# Altium schematic sheet Sheet1.SchDoc
size A2; SheetNumber: 1; SheetTotal: 1
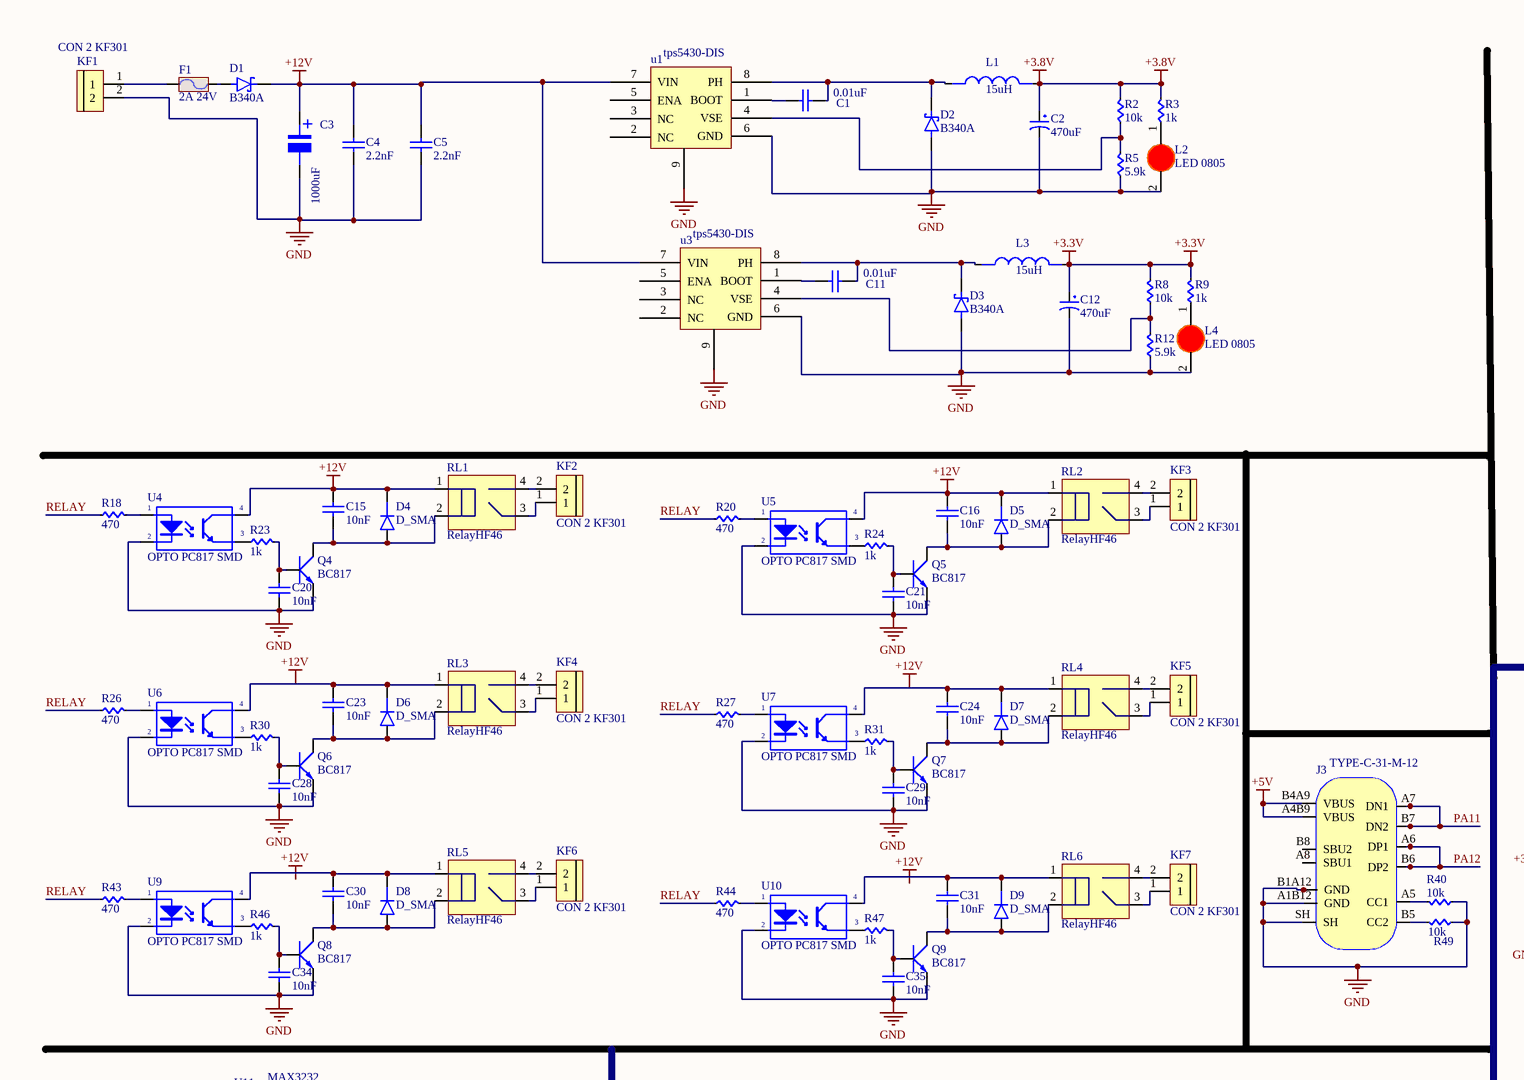
[diagram p0: Sheet1.SchDoc, top left]
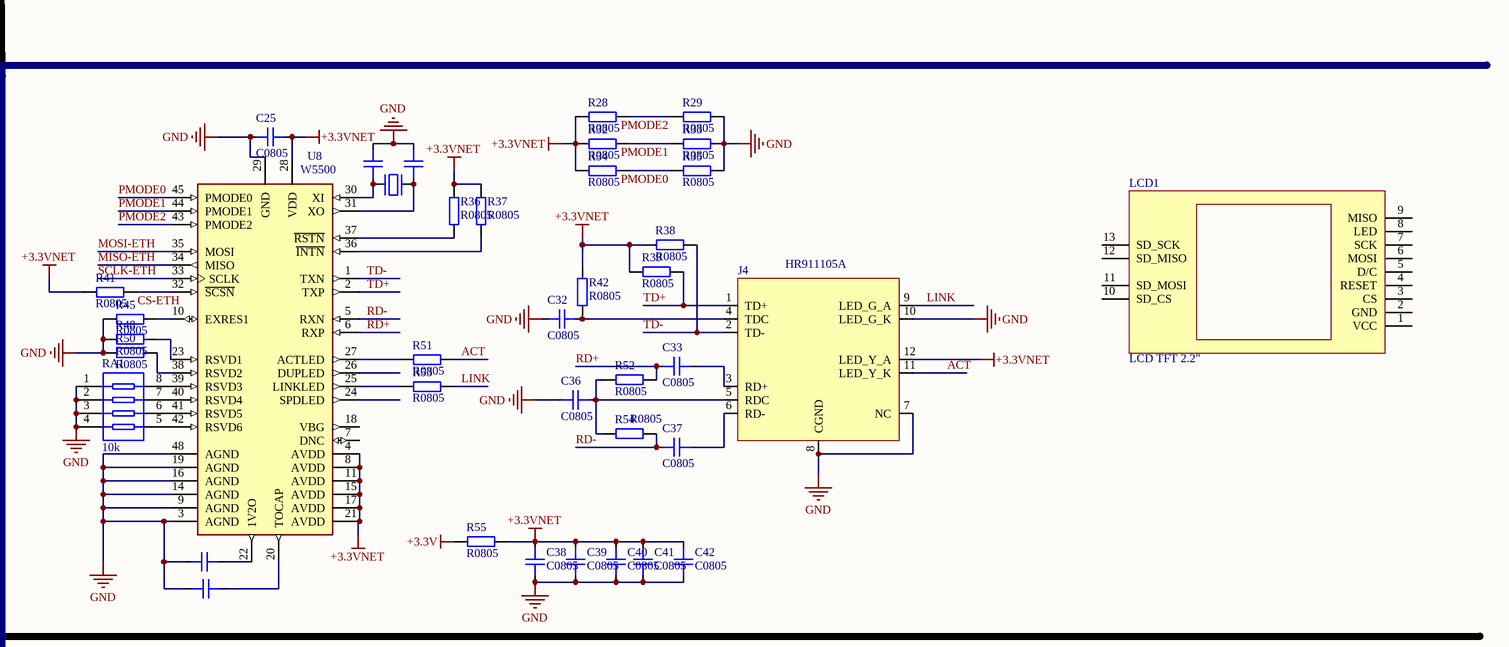
[diagram p1: Sheet1.SchDoc, top right]
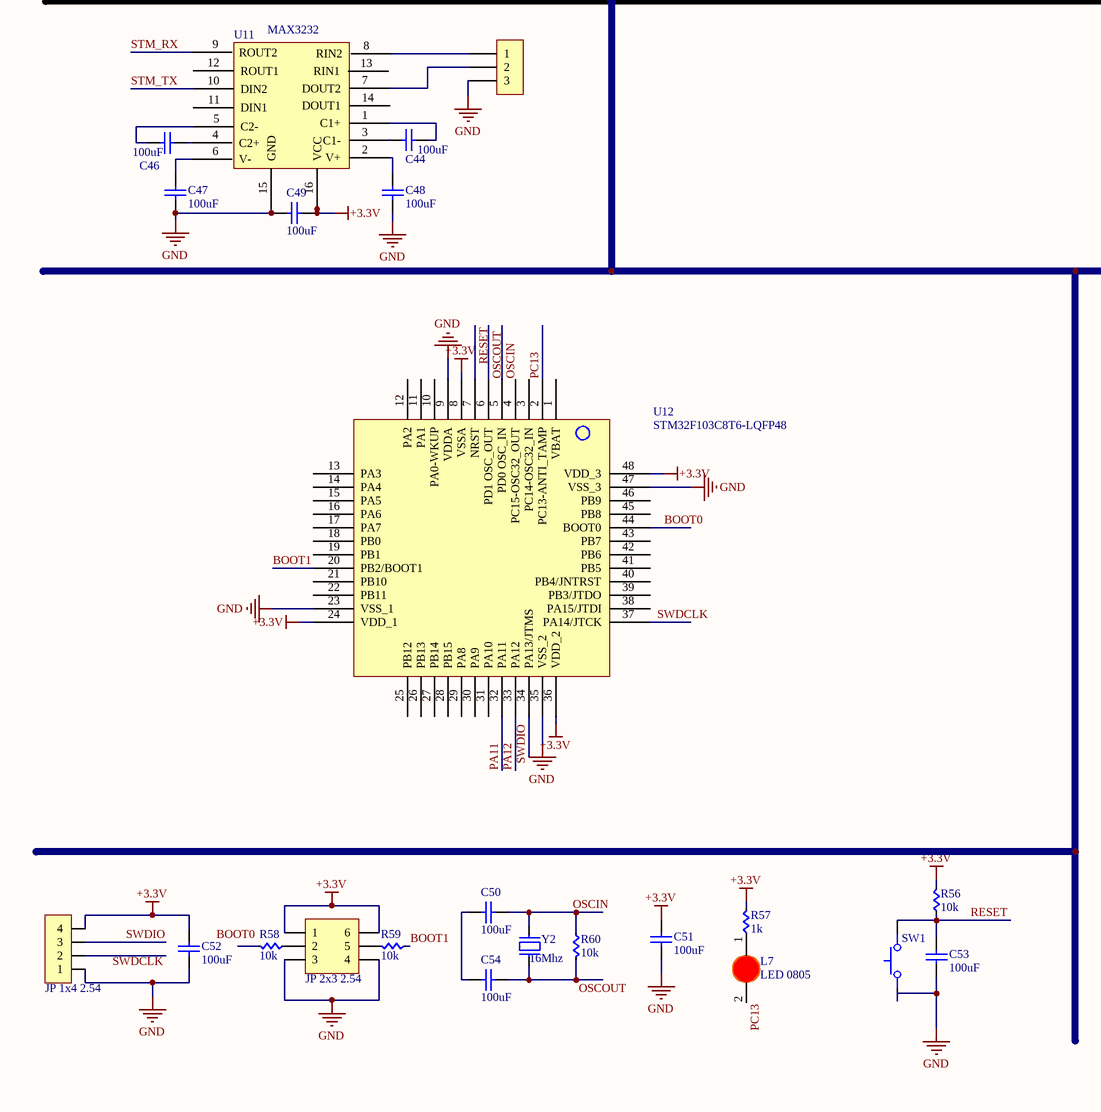
[diagram p2: Sheet1.SchDoc, bottom left]
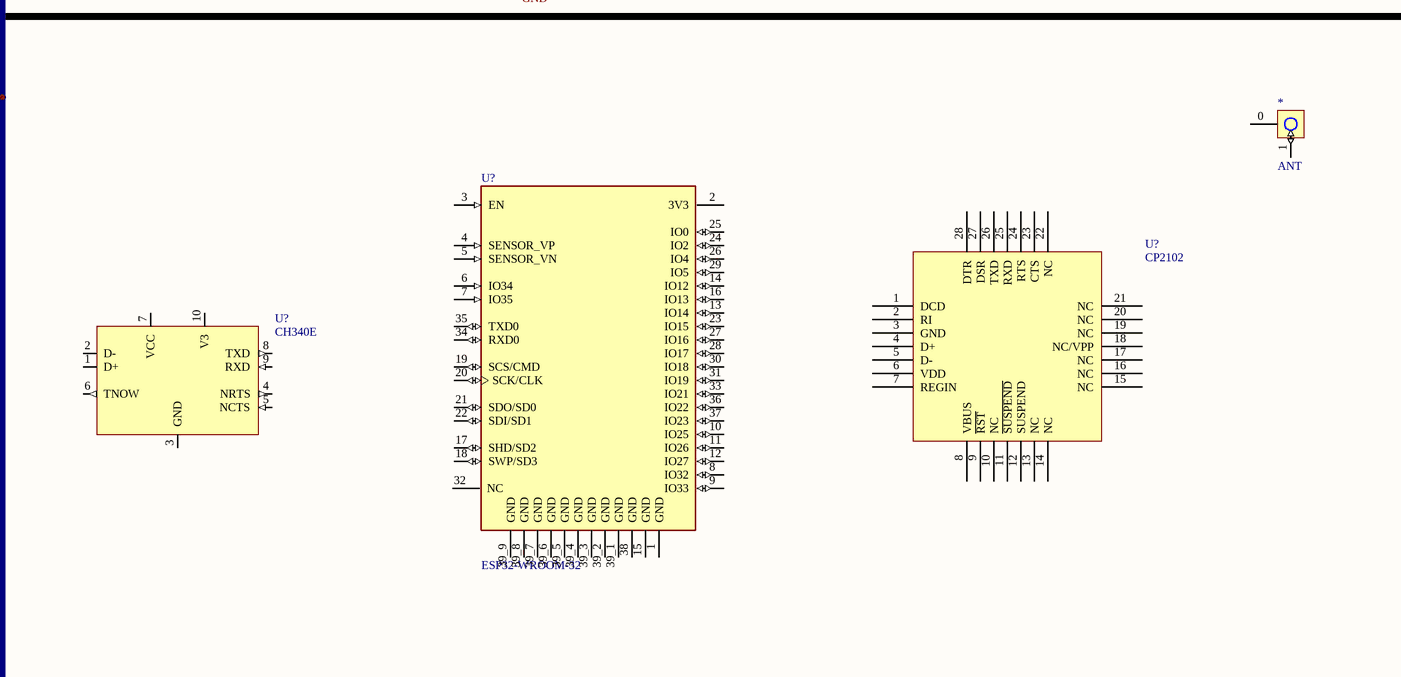
[diagram p3: Sheet1.SchDoc, bottom right]

## Parts
(Parts that share a designator on the sheet are numbered #1, #2 ... from top to bottom, then left to right.)
*  ANT  [ANTENNA SMA-KHD]
C1  0.01uF  [tu 0805]
C2  470uF  [tu tantalum smd7343]
C3  1000uF  [tu nhom 10 (G)]
C4  2.2nF  [tu 0805]
C5  2.2nF  [tu 0805]
C11  0.01uF  [tu 0805]
C12  470uF  [tu tantalum smd7343]
C15  10nF  [tu 0805]
C16  10nF  [tu 0805]
C20  10nF  [tu 0805]
C21  10nF  [tu 0805]
C23  10nF  [tu 0805]
C24  10nF  [tu 0805]
C25  C0805  [CAP_0805]
C26  C0805  [CAP_0805]  (value not drawn)
C27  C0805  [CAP_0805]  (value not drawn)
C28  10nF  [tu 0805]
C29  10nF  [tu 0805]
C30  10nF  [tu 0805]
C31  10nF  [tu 0805]
C32  C0805  [CAP_0805]
C33  C0805  [CAP_0805]
C34  10nF  [tu 0805]
C35  10nF  [tu 0805]
C36  C0805  [CAP_0805]
C37  C0805  [CAP_0805]
C38  C0805  [CAP_0805]
C39  C0805  [CAP_0805]
C40  C0805  [CAP_0805]
C41  C0805  [CAP_0805]
C42  C0805  [CAP_0805]
C43  C0805  [CAP_0805]  (value not drawn)
C44  100uF  [tu 0805]
C45  C0805  [CAP_0805]  (value not drawn)
C46  100uF  [tu 0805]
C47  100uF  [tu 0805]
C48  100uF  [tu 0805]
C49  100uF  [tu 0805]
C50  100uF  [tu 0805]
C51  100uF  [tu 0805]
C52  100uF  [tu 0805]
C53  100uF  [tu 0805]
C54  100uF  [tu 0805]
D1  B340A  [DIOM5226X240N]
D2  B340A  [DIOM5226X240N]
D3  B340A  [DIOM5226X240N]
D4  D_SMA  [DO-214AC-2 (SMA)]
D5  D_SMA  [DO-214AC-2 (SMA)]
D6  D_SMA  [DO-214AC-2 (SMA)]
D7  D_SMA  [DO-214AC-2 (SMA)]
D8  D_SMA  [DO-214AC-2 (SMA)]
D9  D_SMA  [DO-214AC-2 (SMA)]
F1  2A 24V  [Cau chi tu phuc hoi 2A 24V SMD1812]
H1  (no value)  [XH2.54M-3]
J3  TYPE-C-31-M-12  [TYPE-C-31-M-12]
J4  HR911105A  [HR911105A]
JP1  JP 1x4 2.54  [JP 1x4 DT]
JP2  JP 2x3 2.54  [JP 2x3 DT]
KF1  CON 2 KF301  [Con 2 KF301 5.08]
KF2  CON 2 KF301  [Con 2 KF301 5.08]
KF3  CON 2 KF301  [Con 2 KF301 5.08]
KF4  CON 2 KF301  [Con 2 KF301 5.08]
KF5  CON 2 KF301  [Con 2 KF301 5.08]
KF6  CON 2 KF301  [Con 2 KF301 5.08]
KF7  CON 2 KF301  [Con 2 KF301 5.08]
L1  15uH  [CUON CAM SMD 0530]
L2  LED 0805  [LED-0805-Red]
L3  15uH  [CUON CAM SMD 0530]
L4  LED 0805  [LED-0805-Red]
L7  LED 0805  [LED-0805-Red]
LCD1  LCD TFT 2.2"  [LCD TFT 2.2"]
Q4  BC817  [SOT-23]
Q5  BC817  [SOT-23]
Q6  BC817  [SOT-23]
Q7  BC817  [SOT-23]
Q8  BC817  [SOT-23]
Q9  BC817  [SOT-23]
R2  10k  [RES 0805]
R3  1k  [RES 0805]
R5  5.9k  [RES 0805]
R8  10k  [RES 0805]
R9  1k  [RES 0805]
R12  5.9k  [RES 0805]
R18  470  [RES 0805]
R20  470  [RES 0805]
R23  1k  [RES 0805]
R24  1k  [RES 0805]
R26  470  [RES 0805]
R27  470  [RES 0805]
R28  R0805  [RES_0805]
R29  R0805  [RES_0805]
R30  1k  [RES 0805]
R31  1k  [RES 0805]
R32  R0805  [RES_0805]
R33  R0805  [RES_0805]
R34  R0805  [RES_0805]
R35  R0805  [RES_0805]
R36  R0805  [RES_0805]
R37  R0805  [RES_0805]
R38  R0805  [RES_0805]
R39  R0805  [RES_0805]
R40  10k  [RES 0805]
R41  R0805  [RES_0805]
R42  R0805  [RES_0805]
R43  470  [RES 0805]
R44  470  [RES 0805]
R45  R0805  [RES_0805]
R46  1k  [RES 0805]
R47  1k  [RES 0805]
R48  R0805  [RES_0805]
R49  10k  [RES 0805]
R50  R0805  [RES_0805]
R51  R0805  [RES_0805]
R52  R0805  [RES_0805]
R53  R0805  [RES_0805]
R54  R0805  [RES_0805]
R55  R0805  [RES_0805]
R56  10k  [RES 0805]
R57  1k  [RES 0805]
R58  10k  [RES 0805]
R59  10k  [RES 0805]
R60  10k  [RES 0805]
RA1  10k  [RES 0603x4]
RL1  RelayHF46  [Relay 4 chan HF46F]
RL2  RelayHF46  [Relay 4 chan HF46F]
RL3  RelayHF46  [Relay 4 chan HF46F]
RL4  RelayHF46  [Relay 4 chan HF46F]
RL5  RelayHF46  [Relay 4 chan HF46F]
RL6  RelayHF46  [Relay 4 chan HF46F]
SW1  DTSM-3  [DTSM-3]  (value not drawn)
u1  tps5430-DIS  [SOIC127P600X170_HS-8N]
u3  tps5430-DIS  [SOIC127P600X170_HS-8N]
U4  OPTO PC817 SMD  [PC817 SMD]
U5  OPTO PC817 SMD  [PC817 SMD]
U6  OPTO PC817 SMD  [PC817 SMD]
U7  OPTO PC817 SMD  [PC817 SMD]
U8  W5500  [w5500]
U9  OPTO PC817 SMD  [PC817 SMD]
U10  OPTO PC817 SMD  [PC817 SMD]
U11  MAX3232  [TSSOP 16PIN]
U12  STM32F103C8T6-LQFP48  [LQFP 48 PIN]
U?#1  CP2102  [QFN28]
U?#2  CH340E  [MSOP-10]
U?#3  ESP32-WROOM-32  [MODULE_ESP32-WROOM-32]
Y1  16Mhz  [Thach Anh 2 chan SMD]  (value not drawn)
Y2  16Mhz  [Thach Anh 2 chan SMD]

## Nets
+3.3V: C12.1 C49.1 C51.1 C52.1 JP1.4 JP2.1 JP2.6 L3.2 R8.2 R9.2 R55.1 R56.2 R57.2 U11.16(VCC) U12.8(VSSA) U12.24(VDD_1) U12.36(VDD_2) U12.48(VDD_3)
+3.3VNET: C25.2 C38.2 C39.2 C40.2 C41.2 C42.2 J4.12(LED_Y_A) R28.2 R32.2 R34.2 R36.2 R37.2 R38.1 R39.2 R41.1 R42.2 R55.2 U8.4(AVDD) U8.8(AVDD) U8.11(AVDD) U8.15(AVDD) U8.17(AVDD) U8.21(AVDD) U8.28(VDD)
+3.8V: C2.1 L1.2 R2.2 R3.2
+5V: J3.A4B9(VBUS) J3.B4A9(VBUS)
+12V: C3.1 C4.1 C5.1 C15.1 C16.1 C23.1 C24.1 D1.C D4.K D5.K D6.K D7.K RL1.1 RL2.1 RL3.1 RL4.1 u1.7(VIN) u3.7(VIN) U4.4(C) U5.4(C) U6.4(C) U7.4(C)
GND: C2.2 C3.2 C4.2 C5.2 C12.2 C20.2 C21.2 C25.1 C26.2 C27.2 C28.2 C29.2 C32.1 C34.2 C35.2 C36.1 C38.1 C39.1 C40.1 C41.1 C42.1 C43.2 C45.2 C47.1 C48.1 C49.2 C51.2 C52.2 C53.2 D2.A D3.A H1.3 J3.A1B12(GND) J3.B1A12(GND) J3.SH J4.7(NC) J4.8(CGND) J4.10(LED_G_K) JP1.1 JP2.3 JP2.4 KF1.2 L2.2(K) L4.2(K) Q4.2(E) Q5.2(E) Q6.2(E) Q7.2(E) Q8.2(E) Q9.2(E) R5.1 R12.1 R29.1 R33.1 R35.1 R40.1 R45.1 R48.1 R49.1 R50.1 RA1.1 RA1.2 RA1.3 RA1.4 SW1.1 u1.6(GND) u1.9 u3.6(GND) u3.9 U4.2(K) U5.2(K) U6.2(K) U7.2(K) U8.3(AGND) U8.9(AGND) U8.14(AGND) U8.16(AGND) U8.19(AGND) U8.29(GND) U8.48(AGND) U9.2(K) U10.2(K) U11.15(GND) U12.9(VDDA) U12.23(VSS_1) U12.35(VSS_2) U12.47(VSS_3)
ACT: J4.11(LED_Y_K) R51.2
BOOT0: U12.44(BOOT0)
BOOT1: R59.1 U12.20(PB2/BOOT1)
CS-ETH: R41.2 U8.32(~{SCSN})
LINK: J4.9(LED_G_A) R53.2
MISO-ETH: U8.34(MISO)
MOSI-ETH: U8.35(MOSI)
OSCIN: U12.5(PD0_OSC_IN)
OSCOUT: C54.2 R60.2 U12.6(PD1_OSC_OUT) Y2.1
PA11: J3.A7(DN1) J3.B7(DN2) U12.32(PA11)
PA12: J3.A6(DP1) J3.B6(DP2) U12.33(PA12)
PC13: L7.2(K) U12.2(PC13-ANTI_TAMP)
PMODE0: R34.1 R35.2 U8.45(PMODE0)
PMODE1: R32.1 R33.2 U8.44(PMODE1)
PMODE2: R28.1 R29.2 U8.43(PMODE2)
RD+: C33.2 R52.1 U8.6(RXP)
RD-: C37.2 R54.1 U8.5(RXN)
RELAY: R18.1 R20.1 R26.1 R27.1 R43.1 R44.1
RESET: C53.1 R56.1 SW1.2 U12.7(NRST)
SCLK-ETH: U8.33(SCLK)
STM_RX: U11.9(ROUT2)
STM_TX: U11.10(DIN2)
SWDCLK: U12.37(PA14/JTCK)
SWDIO: JP1.3 U12.34(PA13/JTMS)
TD+: J4.1(TD+) R39.1 U8.2(TXP)
TD-: J4.2(TD-) R38.2 U8.1(TXN)
NetC1_1: C1.1 D2.C L1.1 u1.8(PH)
NetC1_2: C1.2 u1.1(BOOT)
NetC11_1: C11.1 D3.C L3.1 u3.8(PH)
NetC11_2: C11.2 u3.1(BOOT)
NetC15_2: C15.2 D4.A Q4.3(C) RL1.2
NetC16_2: C16.2 D5.A Q5.3(C) RL2.2
NetC20_1: C20.1 Q4.1(B) R23.2
NetC21_1: C21.1 Q5.1(B) R24.2
NetC23_2: C23.2 D6.A Q6.3(C) RL3.2
NetC24_2: C24.2 D7.A Q7.3(C) RL4.2
NetC26_1: C26.1 U8.30(XI) Y1.1
NetC27_1: C27.1 U8.31(XO) Y1.2
NetC28_1: C28.1 Q6.1(B) R30.2
NetC29_1: C29.1 Q7.1(B) R31.2
NetC30_1: C30.1 D8.K RL5.1 U9.4(C)
NetC30_2: C30.2 D8.A Q8.3(C) RL5.2
NetC31_1: C31.1 D9.K RL6.1 U10.4(C)
NetC31_2: C31.2 D9.A Q9.3(C) RL6.2
NetC32_2: C32.2 J4.4(TDC) R42.1
NetC33_1: C33.1 J4.3(RD+)
NetC34_1: C34.1 Q8.1(B) R46.2
NetC35_1: C35.1 Q9.1(B) R47.2
NetC36_2: C36.2 J4.5(RDC) R52.2 R54.2
NetC37_1: C37.1 J4.6(RD-)
NetC43_1: C43.1 U8.22(1V2O)
NetC44_1: C44.1 U11.1(C1+)
NetC44_2: C44.2 U11.3(C1-)
NetC45_1: C45.1 U8.20(TOCAP)
NetC46_1: C46.1 U11.4(C2+)
NetC46_2: C46.2 U11.5(C2-)
NetC47_2: C47.2 U11.6(V-)
NetC48_2: C48.2 U11.2(V+)
NetC50_1: C50.1 C54.1
NetC50_2: C50.2 R60.1 Y2.2
NetD1_A: D1.A F1.2
NetF1_1: F1.1 KF1.1
NetH1_1: H1.1 U11.8(RIN2)
NetH1_2: H1.2 U11.7(DOUT2)
NetJ3_A5: J3.A5(CC1) R40.2
NetJ3_B5: J3.B5(CC2) R49.2
NetJP2_2: JP2.2 R58.1
NetJP2_5: JP2.5 R59.2
NetKF2_1: KF2.1 RL1.3(AC/DC)
NetKF2_2: KF2.2 RL1.4(AC/DC)
NetKF3_1: KF3.1 RL2.3(AC/DC)
NetKF3_2: KF3.2 RL2.4(AC/DC)
NetKF4_1: KF4.1 RL3.3(AC/DC)
NetKF4_2: KF4.2 RL3.4(AC/DC)
NetKF5_1: KF5.1 RL4.3(AC/DC)
NetKF5_2: KF5.2 RL4.4(AC/DC)
NetKF6_1: KF6.1 RL5.3(AC/DC)
NetKF6_2: KF6.2 RL5.4(AC/DC)
NetKF7_1: KF7.1 RL6.3(AC/DC)
NetKF7_2: KF7.2 RL6.4(AC/DC)
NetL2_1: L2.1(A) R3.1
NetL4_1: L4.1(A) R9.1
NetL7_1: L7.1(A) R57.1
NetR2_1: R2.1 R5.2 u1.4(VSE)
NetR8_1: R8.1 R12.2 u3.4(VSE)
NetR18_2: R18.2 U4.1(A)
NetR20_2: R20.2 U5.1(A)
NetR23_1: R23.1 U4.3(E)
NetR24_1: R24.1 U5.3(E)
NetR26_2: R26.2 U6.1(A)
NetR27_2: R27.2 U7.1(A)
NetR30_1: R30.1 U6.3(E)
NetR31_1: R31.1 U7.3(E)
NetR36_1: R36.1 U8.37(~{RSTN})
NetR37_1: R37.1 U8.36(~{INTN})
NetR43_2: R43.2 U9.1(A)
NetR44_2: R44.2 U10.1(A)
NetR45_2: R45.2 U8.10(EXRES1)
NetR46_1: R46.1 U9.3(E)
NetR47_1: R47.1 U10.3(E)
NetR48_2: R48.2 U8.23(RSVD1)
NetR50_2: R50.2 U8.38(RSVD2)
NetR51_1: R51.1 U8.27(ACTLED)
NetR53_1: R53.1 U8.25(LINKLED)
NetRA1_5: RA1.5 U8.42(RSVD6)
NetRA1_6: RA1.6 U8.41(RSVD5)
NetRA1_7: RA1.7 U8.40(RSVD4)
NetRA1_8: RA1.8 U8.39(RSVD3)

Not connected (* = marked no-connect by the designer): * 0(GND) 1; J3 A8(SBU1) B8(SBU2); JP1 2; LCD1 1(VCC) 2(GND) 3(CS) 4(RESET) 5(D/C) 6(MOSI) 7(SCK) 8(LED) 9(MISO) 10(SD_CS) 11(SD_MOSI) 12(SD_MISO) 13(SD_SCK); R58 2; u1 2(NC) 3(NC) 5(ENA); u3 2(NC) 3(NC) 5(ENA); U8 7(DNC) 18(VBG) 24(SPDLED) 26(DUPLED); U11 11(DIN1) 12(ROUT1) 13(RIN1) 14(DOUT1); U12 1(VBAT) 3(PC14-OSC32_IN) 4(PC15-OSC32_OUT) 10(PA0-WKUP) 11(PA1) 12(PA2) 13(PA3) 14(PA4) 15(PA5) 16(PA6) 17(PA7) 18(PB0) 19(PB1) 21(PB10) 22(PB11) 25(PB12) 26(PB13) 27(PB14) 28(PB15) 29(PA8) 30(PA9) 31(PA10) 38(PA15/JTDI) 39(PB3/JTDO) 40(PB4/JNTRST) 41(PB5) 42(PB6) 43(PB7) 45(PB8) 46(PB9); U?#1 1(DCD) 2(RI) 3(GND) 4(D+) 5(D-) 6(VDD) 7(REGIN) 8(VBUS) 9(~{RST}) 10(NC) 11(~{SUSPEND}) 12(SUSPEND) 13(NC) 14(NC) 15(NC) 16(NC) 17(NC) 18(NC/VPP) 19(NC) 20(NC) 21(NC) 22(NC) 23(CTS) 24(RTS) 25(RXD) 26(TXD) 27(DSR) 28(DTR); U?#2 1(D+) 2(D-) 3(GND) 4(NRTS) 5(NCTS) 6(TNOW) 7(VCC) 8(TXD) 9(RXD) 10(V3); U?#3 1(GND) 2(3V3) 3(EN) 4(SENSOR_VP) 5(SENSOR_VN) 6(IO34) 7(IO35) 8(IO32) 9(IO33) 10(IO25) 11(IO26) 12(IO27) 13(IO14) 14(IO12) 15(GND) 16(IO13) 17(SHD/SD2) 18(SWP/SD3) 19(SCS/CMD) 20(SCK/CLK) 21(SDO/SD0) 22(SDI/SD1) 23(IO15) 24(IO2) 25(IO0) 26(IO4) 27(IO16) 28(IO17) 29(IO5) 30(IO18) 31(IO19) 32(NC) 33(IO21) 34(RXD0) 35(TXD0) 36(IO22) 37(IO23) 38(GND) 39_1(GND) 39_2(GND) 39_3(GND) 39_4(GND) 39_5(GND) 39_6(GND) 39_7(GND) 39_8(GND) 39_9(GND)

## Notes on the sheet
- Labels drawn without touching a wire or pin: +12V, BOOT0, OSCIN, SWDCLK
- (in symbol Tu Nhom 1000uF 16V) +

## Library data of the parts
C1 C11 C44 C46-C54 = Tu 0805 15pF 50V 10%: Dán; Don_Vi: Con; So_Chan: 2; Ten_Linh_Kien: Tụ 0805 15P 10% 50V; Ma_Hang: MH004556; Chung_Loai: Dán; Kieu_Chan: *
C2 C12 = Tu tantalum 470uF 10V SMD7343: Dán; Don_Vi: Con; So_Chan: 2; Ten_Linh_Kien: Tụ tantalum 477A-470uF 10V SMD7343; Ma_Hang: MH001956; Chung_Loai: Dán; Kieu_Chan: *
C3 = Tu Nhom 1000uF 16V: Dán; Don_Vi: Con; So_Chan: 2; Ten_Linh_Kien: Tụ Nhôm 1000uF 16V 10x10MM; Ma_Hang: MH004419; Chung_Loai: Dán; Kieu_Chan: *
C4 C5 C15 C16 C20 C21 C23 C24 C28-C31 C34 C35 = Tu 0805 22nF 50V 20%: Dán; Don_Vi: Con; So_Chan: 2; Ten_Linh_Kien: Tụ 0805 22nF 50V 20%; Ma_Hang: MH007857; Chung_Loai: Dán; Kieu_Chan: *
C25-C27 C32 C33 C36-C43 C45 = CAP_0805: Capacitor SMD 0805; Manufacturer: *; Manufacturer Part Number: *; Distributor Link: *; LCSC: *; Rating: *; Dielectric: *
D1-D3 = B340A-13-F: Diode Schottky 40V 3A Surface Mount SMA; MF: Diodes Inc.; Availability: Unavailable; MP: B340A-13-F; Price: None; Value: *; SnapEDA_Link: https://www.snapeda.com/parts/B340A-13-F/Diodes%20Inc./view-part/78704/?ref=snap; Package: DO-214 Diodes Inc.
D4-D9 = D_SMA: Diode SMD SMA (DO-214AA)
F1 = Cau chi tu phuc hoi 2A 24V SMD1812: 2A 24V SMD1812; Ma_Hang: MH010033; Ten: Cầu Chì Tự Phục Hồi 2A 24V SMD1812
H1 = Header 3P 2.54 Duc Thang: Cắm; Ten_Linh_Kien: Header 3P XH2.54-3P Đực Thẳng; Don_Vi: Con; Ma_Hang: MH001292; Chung_Loai: Cắm
J3 = TYPE-C-31-M-12: USB Type C Connector Horizontal SMT; Manufacturer: Koren Hroparts; Manufacturer Part Number: TYPE-C-31-M-12
J4 = HR911105A_1: Single Port RJ45 Connector w/ Integrated Magnetic and LED 10/100 Base-T; Manufacturer: HanRun; Manufacturer Part Number: HR911105A
JP1 = JP 1x4 2.54 Duc Thang: Cắm; Ten_Linh_Kien: Jump Đơn Đực 2.54MM 1x40P Thẳng 11MM; Don_Vi: Con; Ma_Hang: MH000903; Ghi_Chu: *; Kieu_Chan: *; Chung_Loai: Cắm
JP2 = JP 2x3 2.54 Duc Thang: Cắm; Ten_Linh_Kien: Jump Đôi Đực 2.54MM 2x40P Thẳng 11MM; Don_Vi: Con; Ma_Hang: MH002686; Ghi_Chu: *; Kieu_Chan: *; Chung_Loai: Cắm
KF1-KF7 = CON 2 KF301: Cắm; Ma_Hang: MH000987; Ten_Linh_Kien: CON 2 KF301-2P 5.08MM Xanh Dương; Chung_Loai: Cắm; Ghi_Chu: *; Kieu_Chan: *; Don_Vi: Con
L1 L3 = Cuon Cam SMD 0530: SMD 0530; MP: FDV0530-H-1R5M=P3; Package: None; Price: None; Value: *; Availability: Unavailable
L2 L4 L7 = LED 0805 Do: Dán; Don_Vi: Con; Ma_Hang: MH000897; Ten_Linh_Kien: LED 0805 Màu Đỏ (Red); Ghi_Chu: *; Kieu_Chan: *; Chung_Loai: Dán
Q4-Q9 = Trans BC817: SOT-23 - C8658; Value: C9014
R2 R8 R40 R49 R56 R58-R60 = RES 0805: RES SMD 0805; Manufacturer: Vishay Dale; Manufacturer Part Number: CRCW040210K0FKED; Tolerance: ±1%; Power (Watts): 0.063W, 1/16W; Temperature Coefficient: ±100ppm/°C; Supplier 1: Digi-Key; RoHS: RoHS Compliant; Category: Resistors; Stock 1: 2392462; Pricing 1: 10=0.083, 50=0.0444, 200=0.0255, 1000=0.0174 (USD); Packaging: Cut Tape (CT); Resistance (Ohms): 10k; Composition: Thick Film; Features: Automotive AEC-Q200; Operating Temperature: -55°C ~ 155°C; Package / Case: 0402 (1005 Metric); Supplier Device Package: 0402 (1005 Metric); Size / Dimension: 0.039" L x 0.020" W (1.00mm x 0.50mm); Height: 0.016" (0.40mm); Number of Terminations: 2; ComponentLink1URL: http://www.vishay.com/docs/20035/dcrcwe3.pdf; ComponentLink1Description: http://www.vishay.com/docs/20035/dcrcwe3.pdf; Supplier Part Number 1: 541-10.0KLCT-ND
R3 R5 R9 R12 R18 R20 R23 R24 R26 R27 R30 R31 R43 R44 R46 R47 R57 = RES 0805: RES SMD 0805; Manufacturer: Vishay Dale; Manufacturer Part Number: CRCW040210K0FKED; Resistance (Ohms): 10k; Tolerance: ±1%; Power (Watts): 0.063W, 1/16W; Temperature Coefficient: ±100ppm/°C; Supplier 1: Digi-Key; RoHS: RoHS Compliant; Category: Resistors; Stock 1: 2392462; Pricing 1: 10=0.083, 50=0.0444, 200=0.0255, 1000=0.0174 (USD); Packaging: Cut Tape (CT); Composition: Thick Film; Features: Automotive AEC-Q200; Operating Temperature: -55°C ~ 155°C; Package / Case: 0402 (1005 Metric); Supplier Device Package: 0402 (1005 Metric); Size / Dimension: 0.039" L x 0.020" W (1.00mm x 0.50mm); Height: 0.016" (0.40mm); Number of Terminations: 2; ComponentLink1URL: http://www.vishay.com/docs/20035/dcrcwe3.pdf; ComponentLink1Description: http://www.vishay.com/docs/20035/dcrcwe3.pdf; Supplier Part Number 1: 541-10.0KLCT-ND
R28 R29 R32-R39 R41 R42 R45 R48 R50-R55 = RES_0805: Resistor SMD 0805; Manufacturer: *; Manufacturer Part Number: *; Distributor Link: *; LCSC: *
RA1 = RES 0603x4
RL1-RL6 = Relay 4 chan HF46F: Ten: Relay 5V5A HF46F-G 5-HS1; Ma_Hang: MH003879
SW1 = DTSM-3: Tactile Switch SMD SPST; Manufacturer: Diptronics; Manufacturer Part Number: DTSM-3
U4-U7 U9 U10 = OPTO PC817 SMD: Single Opto; Value: PC817
U8 = W5500: Hardwired TCP/IP embedded Ethernet controller; Availability: Unavailable; MP: W5500; Value: *; Price: None; Package: None
U?#2 = CH340E: USB-to-UART Transceiver MSOP-10; Manufacturer Part Number: CH340E
U?#3 = ESP32-WROOM-32: Bluetooth, WiFi 802.11b/g/n, Bluetooth v4.2 +EDR, Class 1, 2 and 3 Transceiver Module 2.4GHz ~ 2.5GHz Antenna Not Included, U.FL Surface Mount; MF: Espressif Systems; Price: None; Availability: In Stock; MP: ESP32-WROOM-32; Package: Module Espressif Systems; SnapEDA_Link: https://www.snapeda.com/parts/ESP32-WROOM-32/Espressif+Systems/view-part/?ref=snap; Check_prices: https://www.snapeda.com/parts/ESP32-WROOM-32/Espressif+Systems/view-part/?ref=eda; Value: *; Purchase-URL: https://pricing.snapeda.com/search/part/ESP32-WROOM-32/?ref=eda
Y1 Y2 = Thach Anh 2 chan SMD: Crystal For all Crystal 2pin.; Value: 4Mhz
U12 = STM32F103C8T6-LQFP48: Published: 30-May-2008; DatasheetVersion: rev6, Mar-2008; PackageVersion: Mar-2008; PackageReference: LQFP48; Publisher: Altium Limited; PackageDescription: 48-Pin Low-Profile Quad Flat Pack, 7 x 7 mm Body, 0.5 mm Pitch (LQFP48); ComponentLink1Description: Manufacturer Link; ComponentLink1URL: www.st.com/stm32; ComponentLink2Description: Datasheet; ComponentLink2URL: http://www.st.com/stonline/products/literature/ds/13586.pdf